# EAGLE design Pixie85 (EAGLE 6.5.0)
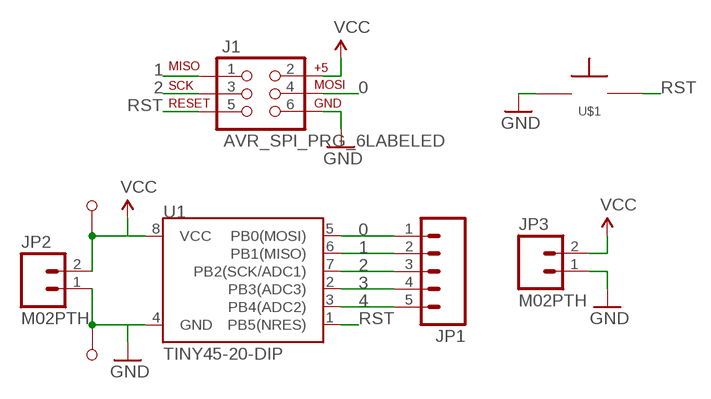
[diagram p0: schematic, sheet 1]

## Parts
+  M1  [M1_NO_STRAIN]
-  M1  [M1_NO_STRAIN]
J1  AVR_SPI_PRG_6LABELED  [2X3-NS]
JP1  M05PTH  [1X05]
JP2  M02PTH  [1X02]
JP3  M02PTH  [1X02]
U1  TINY45-20-DIP  ATTINY45TINY45-20-DIP  [DIP08]
U$1  TAC_SPST_NO  [TAC_SPST_NO]

## Nets
0: J1.4(MOSI) JP1.1 U1.5(PB0(MOSI))
1: J1.1(MISO) JP1.2 U1.6(PB1(MISO))
2: J1.3(SCK) JP1.3 U1.7(PB2(SCK/ADC1))
3: JP1.4 U1.2(PB3(ADC3))
4: JP1.5 U1.3(PB4(ADC2))
GND: -.P$1 J1.6(GND) JP2.1 JP3.1 U1.4(GND) U$1.P$1
RST: J1.5(RST) U1.1(PB5(NRES)) U$1.P$2
VCC: +.P$1 J1.2(V+) JP2.2 JP3.2 U1.8(VCC)

## Library data of the parts
+ - = barbary_enterprises:M1
J1 = barbary_enterprises:AVR_SPI_PRG_6: AVR ISP 6 Pin This is the reduced ISP connector for AVR programming. Common on Arduino. This footprint will take up less PCB space and can be used with a 10-pin to 6-pin adapter such as SKU: BOB-08508
JP1 = SparkFun-Connectors:M05: Header 5 Standard 5-pin 0.1" header. Use with straight break away headers (SKU : PRT-00116), right angle break away headers (PRT-00553), swiss pins (PRT-00743), machine pins (PRT-00117), and female headers (PRT-00115). Molex polarized connector foot print use with SKU : PRT-08230 with associated crimp pins and housings.
JP2 JP3 = SparkFun-Connectors:M02: Standard 2-pin 0.1" header. Use with - straight break away headers ( PRT-00116) - right angle break away headers (PRT-00553) - swiss pins (PRT-00743) - machine pins (PRT-00117) - female headers (PRT-00115) Molex polarized connector foot print use with: PRT-08233 with associated crimp pins and housings. 2.54_SCREWTERM for use with PRT-10571. 3.5mm Screw Terminal footprints for PRT-08084 5mm Screw Terminal footprints for use with PRT-08433
U1 = SparkFun-DigitalIC:ATTINY45: Atmel 8-pin 2/4/8kB flash uC; PROD_ID: IC-09439
U$1 = barbary_enterprises:TAC_SPST_NO: 3,5 mm Tact Switches C&K PTS635 Series * Digi-Key Part Number: CKN9102-ND

## Board
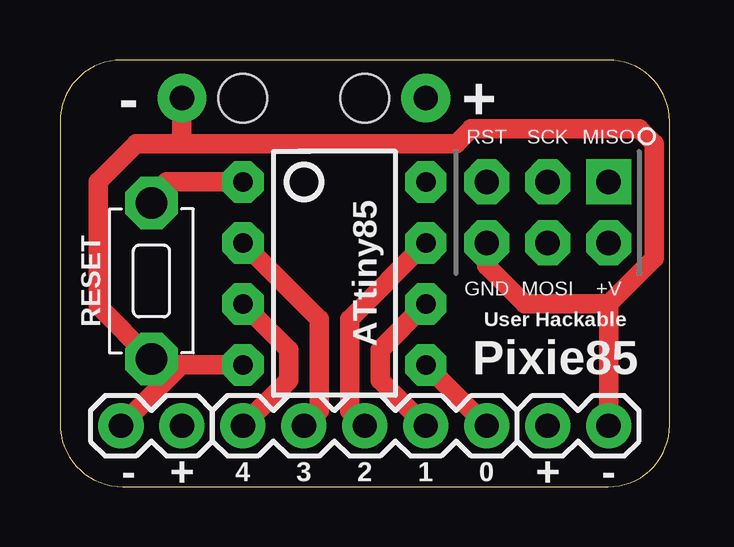
[diagram p1: board, top side]
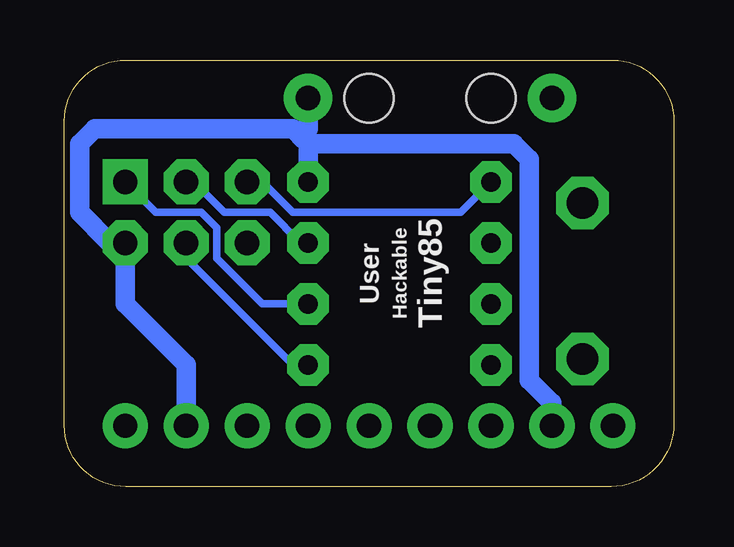
[diagram p2: board, bottom side, seen from below]

Size 25.4 x 17.78 mm. Coordinates in mm from the lower left corner, seen from the top.
Outline: 25.4,2.56 25.4,15.22 arc90 22.84,17.78 2.56,17.78 arc90 0,15.22 0,2.62 arc90 2.62,0 22.84,0 arc90 25.4,2.56
Copper layers (1*16): Top 0.0356mm / dielectric 1.5011mm / Bottom 0.0356mm
Design rules "LaenPCBOrder": minimum track width 6mil, minimum drill 13mil, track to track 6mil, track to pad 6mil, pad to pad 6mil, via to via 6mil, smd to smd 6mil, copper to edge 15mil, drill to drill 6mil, minimum pad ring 7mil, minimum via ring 7mil, stop-mask expansion 3mil, vias tented up to drill 0mil, thermal gap 10mil

### Footprints (pad centres in the part's own frame; a part is rotated, then mirrored left to right if it is on the bottom)
M1_NO_STRAIN = drill 1.016 pad 2.032: P$1 0,0 | hole 2.032: 2.54,0
2X3-NS = drill 1.016 pad 1.88 square: 1 -2.54,-1.27 | drill 1.016 pad 1.88 octagon: 2 -2.54,1.27; 3 0,-1.27; 4 0,1.27; 5 2.54,-1.27; 6 2.54,1.27
1X05 = drill 1.016 pad 1.88: 1 0,0; 2 2.54,0; 3 5.08,0; 4 7.62,0; 5 10.16,0
1X02 = drill 1.016 pad 1.88: 1 0,0; 2 2.54,0
DIP08 = drill 0.813 pad 1.727 octagon: 1 -3.81,-3.81; 2 -1.27,-3.81; 3 1.27,-3.81; 4 3.81,-3.81; 5 3.81,3.81; 6 1.27,3.81; 7 -1.27,3.81; 8 -3.81,3.81
TAC_SPST_NO = drill 1.3 pad 2.184 octagon: P$1 -3.251,0; P$2 3.251,0

### Placement (x,y rotation side)
+  15.24,16.19 180 top
-  5.08,16.19 0 top
J1  20.32,11.43 180 top
JP1  17.78,2.54 180 top
JP2  2.54,2.54 0 top
JP3  22.86,2.54 180 top
U1  11.43,8.89 270 top
U$1  3.81,8.57 90 top

### Tracks (layer width: path | path; a pad name or v marks a point on that pad's centre or on a via)
0
  Top 0.813: JP1.1 U1.5
  Bottom 0.305: U1.5 15.88,5.08 20.32,9.53 J1.4
1
  Top 0.813: JP1.2 13.34,4.45 13.34,5.71 U1.6
  Bottom 0.305: J1.1 21.59,11.43 19.68,11.43 19.05,10.79 19.05,9.53 17.14,7.62 U1.6
2
  Top 0.813: JP1.3 12.06,3.17 12.06,6.99 U1.7
  Bottom 0.305: U1.7 15.56,10.16 16.83,11.43 18.73,11.43 20,12.7 J1.3
3
  Top 0.813: JP1.4 10.79,3.17 10.79,6.99 U1.2
4
  Top 0.813: JP1.5 9.53,4.45 9.53,5.71 U1.3
GND
  Top 0.813: U1.4 5.08,5.08 | 5.08,5.08 JP2.1 | 5.08,5.08 4.13,5.08 U$1.P$1 1.59,7.54 1.59,12.7 3.17,14.29 5.08,14.29 | -.P$1 5.08,14.29 | 5.08,14.29 16.51,14.29 17.14,14.92 24.13,14.92 24.77,14.29 24.77,9.53 22.86,7.62 | 22.86,7.62 JP3.1 | J1.6 17.78,9.21 19.37,7.62 22.86,7.62
RST
  Top 0.813: U1.1 4.45,12.7 U$1.P$2
  Bottom 0.305: U1.1 8.89,11.43 15.88,11.43 17.14,12.7 J1.5
VCC
  Bottom 0.813: JP2.2 5.08,3.49 6.03,4.45 6.03,13.65 6.67,14.29 15.24,14.29 | +.P$1 15.24,14.92 15.56,14.61 | JP3.2 20.32,5.08 22.86,7.62 J1.2 23.5,10.16 24.77,11.43 24.77,14.29 24.13,14.92 15.88,14.92 15.56,14.61 | 15.56,14.61 15.24,14.29 | 15.24,14.29 U1.8

### Text on the board
tPlace: - | + | RESET | ATtiny85 | User Hackable | Pixie85 | - | + | 4 | 3 | 2 | 1 | 0 | + | -
bPlace: Tiny85 | Hackable | User